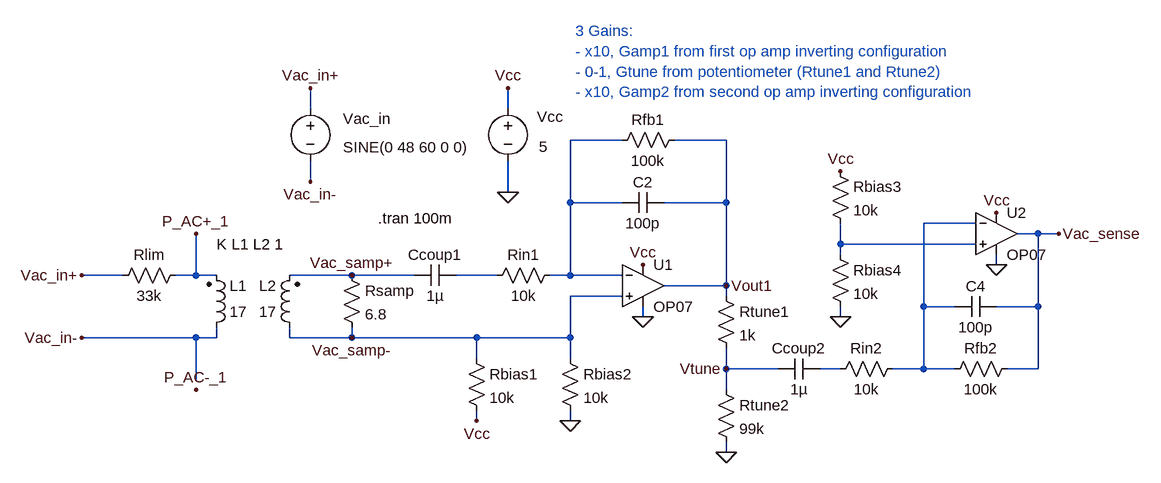
[diagram p0: schematic AC_Voltage_Sensing.asc]
AC_Voltage_Sensing.asc, the LTspice schematic file:
Version 4
SHEET 1 1568 680
WIRE 256 -144 256 -176
WIRE 560 -144 560 -176
WIRE 736 -96 656 -96
WIRE 896 -96 816 -96
WIRE 256 -32 256 -64
WIRE 560 -16 560 -64
WIRE 656 0 656 -96
WIRE 736 0 656 0
WIRE 896 0 896 -96
WIRE 896 0 800 0
WIRE 1280 32 1200 32
WIRE 1376 48 1344 48
WIRE 1408 48 1376 48
WIRE 1072 64 1072 32
WIRE 1280 64 1072 64
WIRE 1072 80 1072 64
WIRE 1312 96 1312 80
WIRE -32 112 -96 112
WIRE 80 112 80 48
WIRE 80 112 48 112
WIRE 112 112 80 112
WIRE 320 112 224 112
WIRE 416 112 320 112
WIRE 544 112 480 112
WIRE 656 112 656 0
WIRE 656 112 624 112
WIRE 736 112 656 112
WIRE 896 128 896 0
WIRE 896 128 800 128
WIRE 736 144 656 144
WIRE 896 144 896 128
WIRE 1200 160 1200 32
WIRE 1248 160 1200 160
WIRE 1376 160 1376 48
WIRE 1376 160 1312 160
WIRE 768 176 768 160
WIRE 1072 176 1072 160
WIRE 80 208 -96 208
WIRE 112 208 112 192
WIRE 112 208 80 208
WIRE 224 208 224 192
WIRE 320 208 320 192
WIRE 320 208 224 208
WIRE 512 208 320 208
WIRE 656 208 656 144
WIRE 656 208 512 208
WIRE 512 240 512 208
WIRE 656 240 656 208
WIRE 896 256 896 224
WIRE 976 256 896 256
WIRE 1072 256 1040 256
WIRE 1200 256 1200 160
WIRE 1200 256 1152 256
WIRE 1248 256 1200 256
WIRE 1376 256 1376 160
WIRE 1376 256 1328 256
WIRE 80 272 80 208
WIRE 896 288 896 256
WIRE 512 336 512 320
WIRE 656 336 656 320
WIRE 896 384 896 368
FLAG 560 -176 Vcc
FLAG 512 336 Vcc
FLAG 656 336 0
FLAG 768 176 0
FLAG 768 96 Vcc
FLAG 896 384 0
FLAG 1312 96 0
FLAG 1312 16 Vcc
FLAG 1072 176 0
FLAG 1072 -48 Vcc
FLAG 1408 48 Vac_sense
FLAG 560 -16 0
FLAG -96 112 Vac_in+
FLAG -96 208 Vac_in-
FLAG 80 48 P_AC+_1
FLAG 80 288 P_AC-_1
FLAG 896 256 Vtune
FLAG 896 128 Vout1
FLAG 320 112 Vac_samp+
FLAG 320 208 Vac_samp-
FLAG 256 -176 Vac_in+
FLAG 256 -32 Vac_in-
SYMBOL ind2 96 208 M180
WINDOW 0 36 80 Left 2
WINDOW 3 36 40 Left 2
SYMATTR InstName L1
SYMATTR Value 17
SYMATTR Type ind
SYMBOL ind2 240 208 R180
WINDOW 0 36 80 Left 2
WINDOW 3 36 40 Left 2
SYMATTR InstName L2
SYMATTR Value 17
SYMATTR Type ind
SYMBOL res 64 96 R90
WINDOW 0 0 56 VBottom 2
WINDOW 3 32 56 VTop 2
SYMATTR InstName Rlim
SYMATTR Value 33k
SYMBOL res 304 96 R0
SYMATTR InstName Rsamp
SYMATTR Value 6.8
SYMBOL cap 480 96 R90
WINDOW 0 0 32 VBottom 2
WINDOW 3 32 32 VTop 2
SYMATTR InstName Ccoup1
SYMATTR Value 1µ
SYMBOL res 640 96 R90
WINDOW 0 0 56 VBottom 2
WINDOW 3 32 56 VTop 2
SYMATTR InstName Rin1
SYMATTR Value 10k
SYMBOL res 496 224 R0
SYMATTR InstName Rbias1
SYMATTR Value 10k
SYMBOL res 640 224 R0
SYMATTR InstName Rbias2
SYMATTR Value 10k
SYMBOL voltage 560 -160 R0
WINDOW 123 0 0 Left 0
WINDOW 39 0 0 Left 0
WINDOW 0 45 28 Left 2
WINDOW 3 48 74 Left 2
SYMATTR InstName Vcc
SYMATTR Value 5
SYMBOL Opamps\\OP07 768 64 R0
SYMATTR InstName U1
SYMBOL cap 800 -16 R90
WINDOW 0 0 32 VBottom 2
WINDOW 3 32 32 VTop 2
SYMATTR InstName C2
SYMATTR Value 100p
SYMBOL res 832 -112 R90
WINDOW 0 0 56 VBottom 2
WINDOW 3 32 56 VTop 2
SYMATTR InstName Rfb1
SYMATTR Value 100k
SYMBOL res 880 272 R0
SYMATTR InstName Rtune2
SYMATTR Value 99k
SYMBOL cap 1040 240 R90
WINDOW 0 0 32 VBottom 2
WINDOW 3 32 32 VTop 2
SYMATTR InstName Ccoup2
SYMATTR Value 1µ
SYMBOL res 1168 240 R90
WINDOW 0 0 56 VBottom 2
WINDOW 3 32 56 VTop 2
SYMATTR InstName Rin2
SYMATTR Value 10k
SYMBOL Opamps\\OP07 1312 -16 R0
SYMATTR InstName U2
SYMBOL cap 1312 144 R90
WINDOW 0 0 32 VBottom 2
WINDOW 3 32 32 VTop 2
SYMATTR InstName C4
SYMATTR Value 100p
SYMBOL res 1344 240 R90
WINDOW 0 0 56 VBottom 2
WINDOW 3 32 56 VTop 2
SYMATTR InstName Rfb2
SYMATTR Value 100k
SYMBOL res 1056 -64 R0
SYMATTR InstName Rbias3
SYMATTR Value 10k
SYMBOL res 1056 64 R0
SYMATTR InstName Rbias4
SYMATTR Value 10k
SYMBOL voltage 256 -160 R0
WINDOW 123 0 0 Left 0
WINDOW 39 0 0 Left 0
WINDOW 0 50 31 Left 2
WINDOW 3 50 75 Left 2
SYMATTR InstName Vac_in
SYMATTR Value SINE(0 48 60 0 0)
SYMBOL res 880 128 R0
SYMATTR InstName Rtune1
SYMATTR Value 1k
TEXT 112 64 Left 2 !K L1 L2 1
TEXT 360 24 Left 2 !.tran 100m
TEXT 664 -264 Left 2 ;3 Gains: \n- x10, Gamp1 from first op amp inverting configuration\n- 0-1, Gtune from potentiometer (Rtune1 and Rtune2)\n- x10, Gamp2 from second op amp inverting configuration

The netlist it stands for:
* AC_Voltage_Sensing.asc
L1 Vac_in- P_AC+_1 17
L2 Vac_samp- Vac_samp+ 17
Rlim P_AC+_1 Vac_in+ 33k
Rsamp Vac_samp+ Vac_samp- 6.8
Ccoup1 N004 Vac_samp+ 1µ
Rin1 N001 N004 10k
Rbias1 Vac_samp- Vcc 10k
Rbias2 Vac_samp- 0 10k
Vcc Vcc 0 5
XU1 Vac_samp- N001 Vcc 0 Vout1 LT1001  ; OP07, pins In+ In- V+ V- OUT
C2 Vout1 N001 100p
Rfb1 Vout1 N001 100k
Rtune2 Vtune 0 99k
Ccoup2 N005 Vtune 1µ
Rin2 N002 N005 10k
XU2 N003 N002 Vcc 0 Vac_sense LT1001  ; OP07, pins In+ In- V+ V- OUT
C4 Vac_sense N002 100p
Rfb2 Vac_sense N002 100k
Rbias3 Vcc N003 10k
Rbias4 N003 0 10k
Vac_in Vac_in+ Vac_in- SINE(0 48 60 0 0)
Rtune1 Vout1 Vtune 1k
K L1 L2 1
.tran 100m
* 3 Gains:
* - x10, Gamp1 from first op amp inverting configuration
* - 0-1, Gtune from potentiometer (Rtune1 and Rtune2)
* - x10, Gamp2 from second op amp inverting configuration
.lib LTC.lib
.backanno
.end